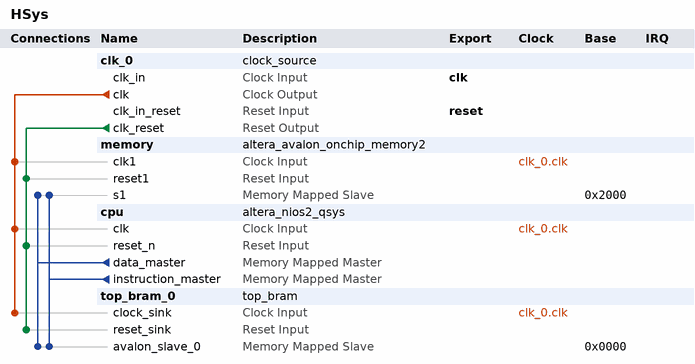
[diagram p0: system contents]
# Platform Designer (Qsys) system HSys, Cyclone II EP2C35F672C6
# Parameters at their usual value, and those the tool derives, are not listed.
package require -exact qsys 13.0
create_system HSys
set_project_property DEVICE_FAMILY {Cyclone II}
set_project_property DEVICE EP2C35F672C6

add_instance clk_0 clock_source 13.0
set_instance_parameter_value clk_0 clockFrequency 25000000

add_instance memory altera_avalon_onchip_memory2 13.0.1.99.2
set_instance_parameter_value memory dataWidth 64
set_instance_parameter_value memory dualPort false
set_instance_parameter_value memory initMemContent true
set_instance_parameter_value memory initializationFileName onchip_mem.hex
set_instance_parameter_value memory memorySize 8192

add_instance cpu altera_nios2_qsys 13.0
set_instance_parameter_value cpu resetSlave memory.s1
set_instance_parameter_value cpu mmu_TLBMissExcSlave None
set_instance_parameter_value cpu exceptionSlave memory.s1
set_instance_parameter_value cpu breakSlave memory.s1
set_instance_parameter_value cpu impl Tiny
set_instance_parameter_value cpu icache_size 4096
set_instance_parameter_value cpu debug_level NoDebug

add_instance top_bram_0 top_bram 1.0

# connections
add_connection clk_0.clk cpu.clk clock
add_connection clk_0.clk memory.clk1 clock
add_connection clk_0.clk top_bram_0.clock_sink clock
add_connection clk_0.clk_reset cpu.reset_n reset
add_connection clk_0.clk_reset memory.reset1 reset
add_connection clk_0.clk_reset top_bram_0.reset_sink reset
add_connection cpu.data_master memory.s1 avalon
set_connection_parameter_value cpu.data_master/memory.s1 baseAddress 0x2000
add_connection cpu.data_master top_bram_0.avalon_slave_0 avalon
set_connection_parameter_value cpu.data_master/top_bram_0.avalon_slave_0 baseAddress 0x0000
add_connection cpu.instruction_master memory.s1 avalon
set_connection_parameter_value cpu.instruction_master/memory.s1 baseAddress 0x2000
add_connection cpu.instruction_master top_bram_0.avalon_slave_0 avalon
set_connection_parameter_value cpu.instruction_master/top_bram_0.avalon_slave_0 baseAddress 0x0000

# exported interfaces
add_interface clk clock sink
set_interface_property clk EXPORT_OF clk_0.clk_in
add_interface reset reset sink
set_interface_property reset EXPORT_OF clk_0.clk_in_reset

set_interconnect_requirement {$system} qsys_mm.clockCrossingAdapter HANDSHAKE
set_interconnect_requirement {$system} qsys_mm.maxAdditionalLatency 1

save_system HSys.qsys
